# Altium schematic sheet PICO,LCD.SchDoc
size A3; SheetNumber: 1; SheetTotal: 2
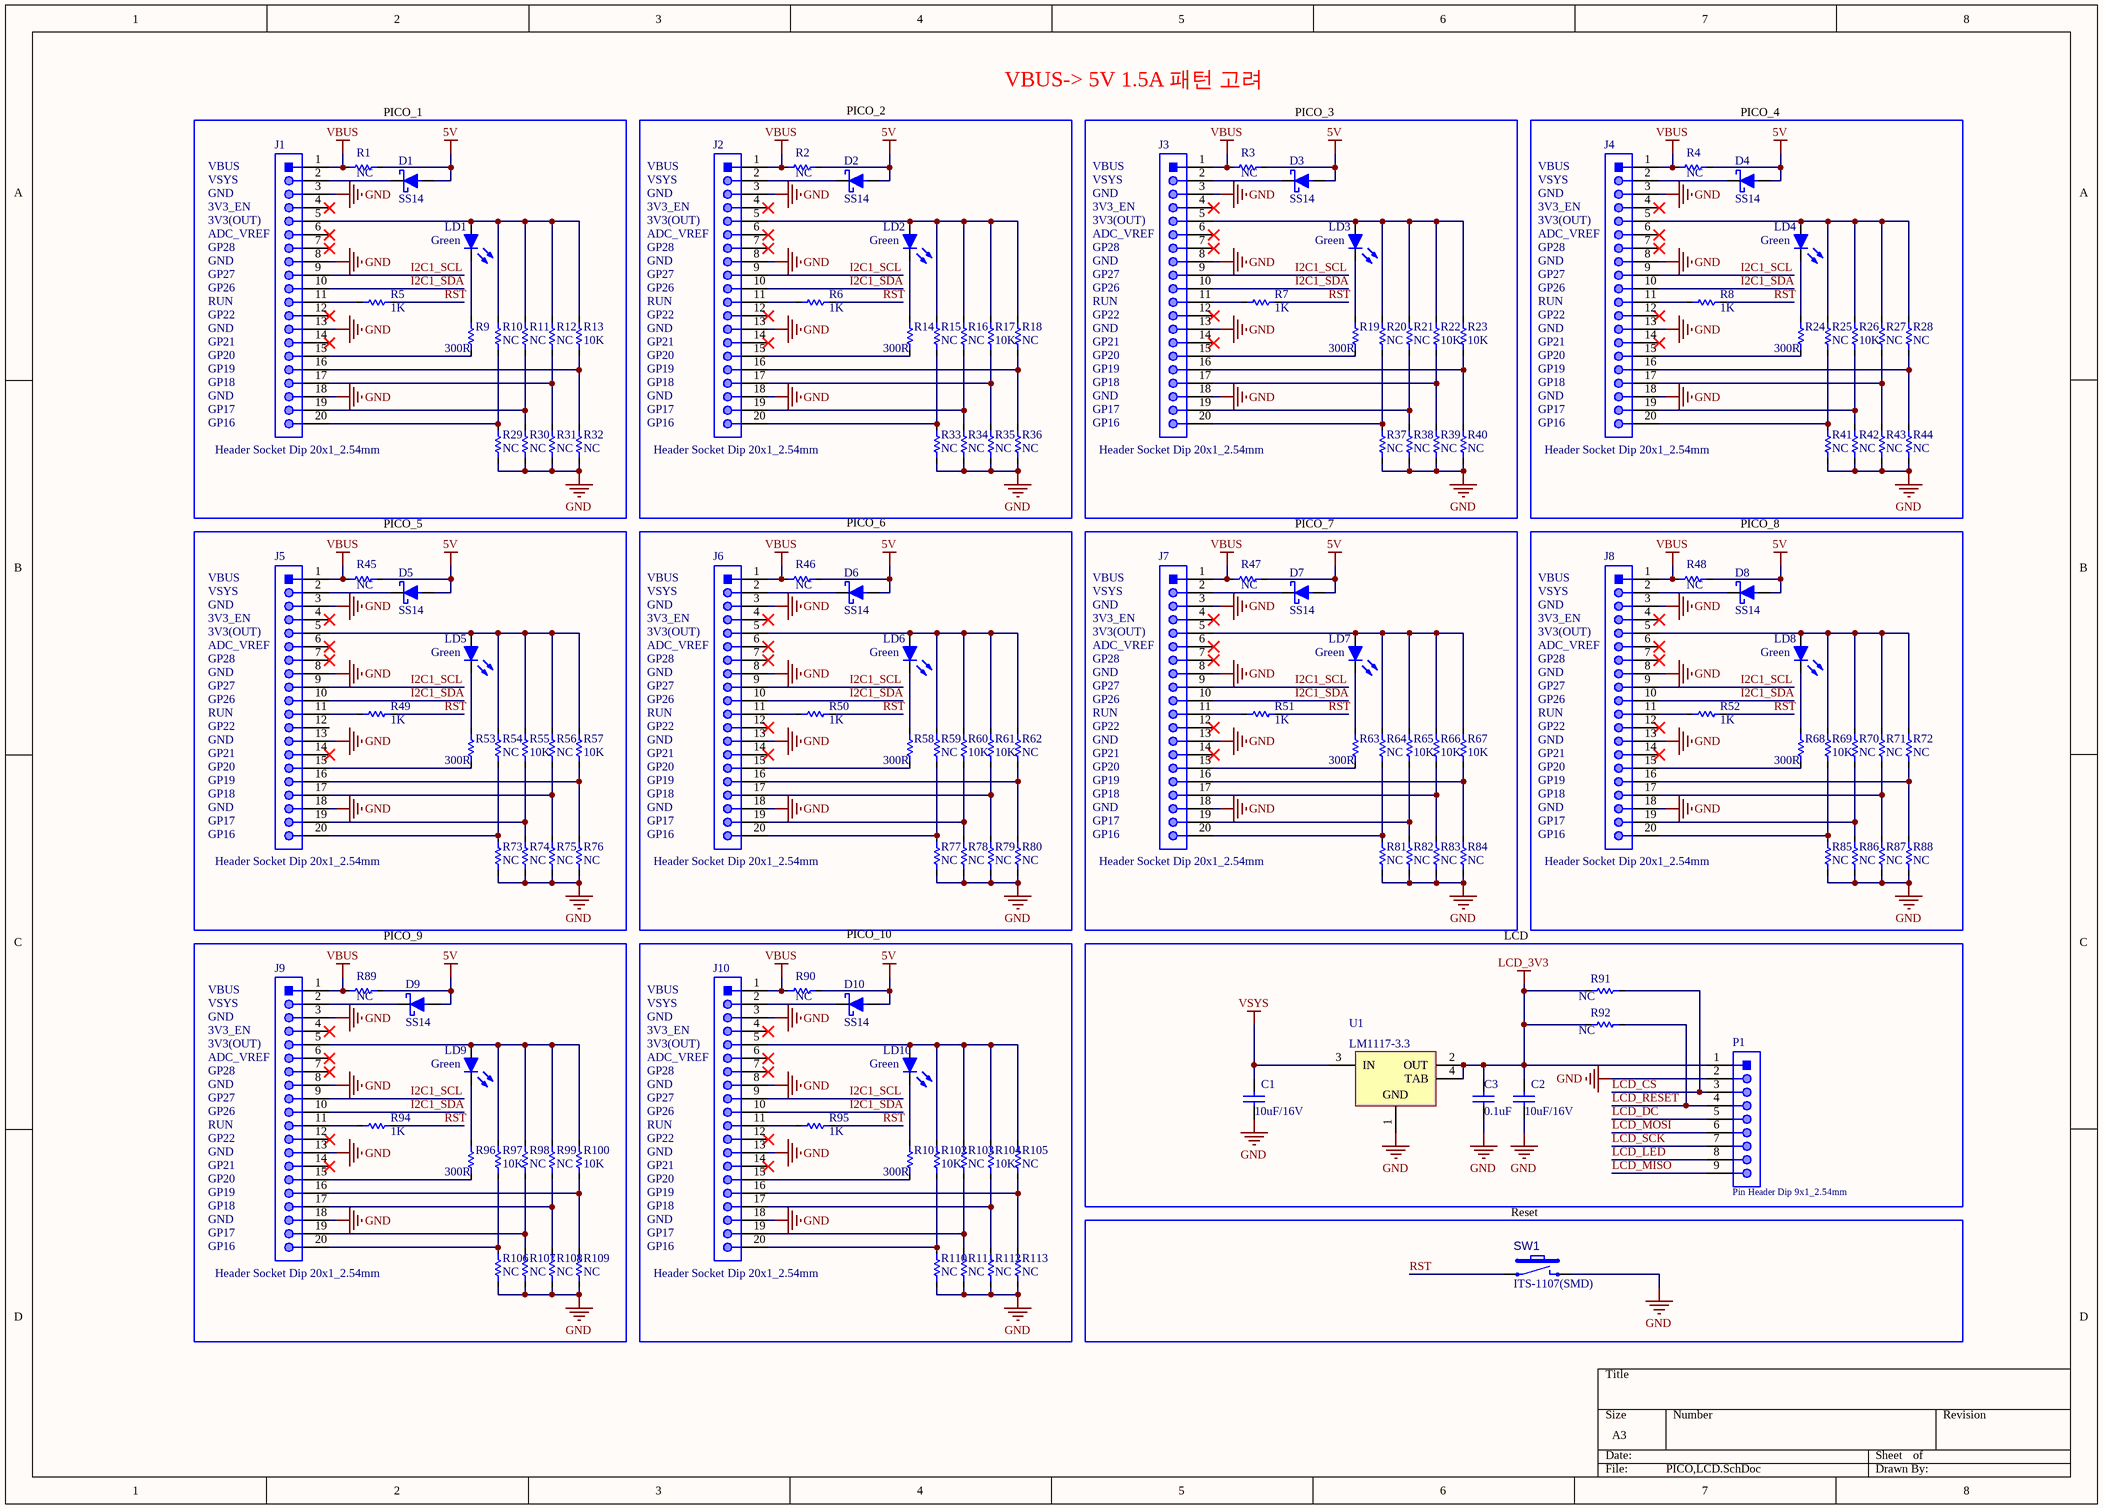
[diagram p0: PICO,LCD.SchDoc]

## Parts
C1  10uF/16V  [CAP-0805]
C2  10uF/16V  [CAP-0805]
C3  0.1uF  [CAP-0603]
D1  SS14  [DO-214AC/SMA]
D2  SS14  [DO-214AC/SMA]
D3  SS14  [DO-214AC/SMA]
D4  SS14  [DO-214AC/SMA]
D5  SS14  [DO-214AC/SMA]
D6  SS14  [DO-214AC/SMA]
D7  SS14  [DO-214AC/SMA]
D8  SS14  [DO-214AC/SMA]
D9  SS14  [DO-214AC/SMA]
D10  SS14  [DO-214AC/SMA]
J1  Header Socket Dip 20x1_2.54mm  [IDC-1X20(SOCKET)]
J2  Header Socket Dip 20x1_2.54mm  [IDC-1X20(SOCKET)]
J3  Header Socket Dip 20x1_2.54mm  [IDC-1X20(SOCKET)]
J4  Header Socket Dip 20x1_2.54mm  [IDC-1X20(SOCKET)]
J5  Header Socket Dip 20x1_2.54mm  [IDC-1X20(SOCKET)]
J6  Header Socket Dip 20x1_2.54mm  [IDC-1X20(SOCKET)]
J7  Header Socket Dip 20x1_2.54mm  [IDC-1X20(SOCKET)]
J8  Header Socket Dip 20x1_2.54mm  [IDC-1X20(SOCKET)]
J9  Header Socket Dip 20x1_2.54mm  [IDC-1X20(SOCKET)]
J10  Header Socket Dip 20x1_2.54mm  [IDC-1X20(SOCKET)]
LD1  Green  [LED-0603-GREEN]
LD2  Green  [LED-0603-GREEN]
LD3  Green  [LED-0603-GREEN]
LD4  Green  [LED-0603-GREEN]
LD5  Green  [LED-0603-GREEN]
LD6  Green  [LED-0603-GREEN]
LD7  Green  [LED-0603-GREEN]
LD8  Green  [LED-0603-GREEN]
LD9  Green  [LED-0603-GREEN]
LD10  Green  [LED-0603-GREEN]
P1  Pin Header Dip 9x1_2.54mm  [LCD(PIN HEADER9X1_2.54)]
R1  NC  [RES-0603]
R2  NC  [RES-0603]
R3  NC  [RES-0603]
R4  NC  [RES-0603]
R5  1K  [RES-0603]
R6  1K  [RES-0603]
R7  1K  [RES-0603]
R8  1K  [RES-0603]
R9  300R  [RES-0603]
R10  NC  [RES-0603]
R11  NC  [RES-0603]
R12  NC  [RES-0603]
R13  10K  [RES-0603]
R14  300R  [RES-0603]
R15  NC  [RES-0603]
R16  NC  [RES-0603]
R17  10K  [RES-0603]
R18  NC  [RES-0603]
R19  300R  [RES-0603]
R20  NC  [RES-0603]
R21  NC  [RES-0603]
R22  10K  [RES-0603]
R23  10K  [RES-0603]
R24  300R  [RES-0603]
R25  NC  [RES-0603]
R26  10K  [RES-0603]
R27  NC  [RES-0603]
R28  NC  [RES-0603]
R29  NC  [RES-0603]
R30  NC  [RES-0603]
R31  NC  [RES-0603]
R32  NC  [RES-0603]
R33  NC  [RES-0603]
R34  NC  [RES-0603]
R35  NC  [RES-0603]
R36  NC  [RES-0603]
R37  NC  [RES-0603]
R38  NC  [RES-0603]
R39  NC  [RES-0603]
R40  NC  [RES-0603]
R41  NC  [RES-0603]
R42  NC  [RES-0603]
R43  NC  [RES-0603]
R44  NC  [RES-0603]
R45  NC  [RES-0603]
R46  NC  [RES-0603]
R47  NC  [RES-0603]
R48  NC  [RES-0603]
R49  1K  [RES-0603]
R50  1K  [RES-0603]
R51  1K  [RES-0603]
R52  1K  [RES-0603]
R53  300R  [RES-0603]
R54  NC  [RES-0603]
R55  10K  [RES-0603]
R56  NC  [RES-0603]
R57  10K  [RES-0603]
R58  300R  [RES-0603]
R59  NC  [RES-0603]
R60  10K  [RES-0603]
R61  10K  [RES-0603]
R62  NC  [RES-0603]
R63  300R  [RES-0603]
R64  NC  [RES-0603]
R65  10K  [RES-0603]
R66  10K  [RES-0603]
R67  10K  [RES-0603]
R68  300R  [RES-0603]
R69  10K  [RES-0603]
R70  NC  [RES-0603]
R71  NC  [RES-0603]
R72  NC  [RES-0603]
R73  NC  [RES-0603]
R74  NC  [RES-0603]
R75  NC  [RES-0603]
R76  NC  [RES-0603]
R77  NC  [RES-0603]
R78  NC  [RES-0603]
R79  NC  [RES-0603]
R80  NC  [RES-0603]
R81  NC  [RES-0603]
R82  NC  [RES-0603]
R83  NC  [RES-0603]
R84  NC  [RES-0603]
R85  NC  [RES-0603]
R86  NC  [RES-0603]
R87  NC  [RES-0603]
R88  NC  [RES-0603]
R89  NC  [RES-0603]
R90  NC  [RES-0603]
R91  NC  [RES-0603]
R92  NC  [RES-0603]
R94  1K  [RES-0603]
R95  1K  [RES-0603]
R96  300R  [RES-0603]
R97  10K  [RES-0603]
R98  NC  [RES-0603]
R99  NC  [RES-0603]
R100  10K  [RES-0603]
R101  300R  [RES-0603]
R102  10K  [RES-0603]
R103  NC  [RES-0603]
R104  10K  [RES-0603]
R105  NC  [RES-0603]
R106  NC  [RES-0603]
R107  NC  [RES-0603]
R108  NC  [RES-0603]
R109  NC  [RES-0603]
R110  NC  [RES-0603]
R111  NC  [RES-0603]
R112  NC  [RES-0603]
R113  NC  [RES-0603]
SW1  ITS-1107(SMD)  [IT-1107(SMD)]
U1  LM1117-3.3  [SOT-223]

## Blocks framed on the sheet
LCD: C1-C3 P1 R91 R92 U1
Reset: SW1

## Nets
5V: D1.1(A) D2.1(A) D3.1(A) D4.1(A) D5.1(A) D6.1(A) D7.1(A) D8.1(A) D9.1(A) D10.1(A) R1.1 R2.1 R3.1 R4.1 R45.1 R46.1 R47.1 R48.1 R89.1 R90.1
GND: C1.1 C2.1 C3.1 J1.3 J1.8 J1.13 J1.18 J2.3 J2.8 J2.13 J2.18 J3.3 J3.8 J3.13 J3.18 J4.3 J4.8 J4.13 J4.18 J5.3 J5.8 J5.13 J5.18 J6.3 J6.8 J6.13 J6.18 J7.3 J7.8 J7.13 J7.18 J8.3 J8.8 J8.13 J8.18 J9.3 J9.8 J9.13 J9.18 J10.3 J10.8 J10.13 J10.18 P1.2 R29.1 R30.1 R31.1 R32.1 R33.1 R34.1 R35.1 R36.1 R37.1 R38.1 R39.1 R40.1 R41.1 R42.1 R43.1 R44.1 R73.1 R74.1 R75.1 R76.1 R77.1 R78.1 R79.1 R80.1 R81.1 R82.1 R83.1 R84.1 R85.1 R86.1 R87.1 R88.1 R106.1 R107.1 R108.1 R109.1 R110.1 R111.1 R112.1 R113.1 SW1.2 U1.1(GND)
LCD_3V3: C2.2 C3.2 P1.1 R91.2 R92.2 U1.2(OUT) U1.4(TAB)
VBUS: J1.1 J2.1 J3.1 J4.1 J5.1 J6.1 J7.1 J8.1 J9.1 J10.1 R1.2 R2.2 R3.2 R4.2 R45.2 R46.2 R47.2 R48.2 R89.2 R90.2
VSYS: C1.2 U1.3(IN)
I2C1_SCL: J1.9 J2.9 J3.9 J4.9 J5.9 J6.9 J7.9 J8.9 J9.9 J10.9
I2C1_SDA: J1.10 J2.10 J3.10 J4.10 J5.10 J6.10 J7.10 J8.10 J9.10 J10.10
LCD_CS: P1.3 R91.1
LCD_DC: P1.5
LCD_LED: P1.8
LCD_MISO: P1.9
LCD_MOSI: P1.6
LCD_RESET: P1.4 R92.1
LCD_SCK: P1.7
RST: R5.1 R6.1 R7.1 R8.1 R49.1 R50.1 R51.1 R52.1 R94.1 R95.1 SW1.1
NetD1_2: D1.2(C) J1.2
NetD2_2: D2.2(C) J2.2
NetD3_2: D3.2(C) J3.2
NetD4_2: D4.2(C) J4.2
NetD5_2: D5.2(C) J5.2
NetD6_2: D6.2(C) J6.2
NetD7_2: D7.2(C) J7.2
NetD8_2: D8.2(C) J8.2
NetD9_2: D9.2(C) J9.2
NetD10_2: D10.2(C) J10.2
NetJ1_5: J1.5 LD1.1(A) R10.2 R11.2 R12.2 R13.2
NetJ1_11: J1.11 R5.2
NetJ1_15: J1.15 R9.2
NetJ1_16: J1.16 R13.1 R32.2
NetJ1_17: J1.17 R12.1 R31.2
NetJ1_19: J1.19 R11.1 R30.2
NetJ1_20: J1.20 R10.1 R29.2
NetJ2_5: J2.5 LD2.1(A) R15.2 R16.2 R17.2 R18.2
NetJ2_11: J2.11 R6.2
NetJ2_15: J2.15 R14.2
NetJ2_16: J2.16 R18.1 R36.2
NetJ2_17: J2.17 R17.1 R35.2
NetJ2_19: J2.19 R16.1 R34.2
NetJ2_20: J2.20 R15.1 R33.2
NetJ3_5: J3.5 LD3.1(A) R20.2 R21.2 R22.2 R23.2
NetJ3_11: J3.11 R7.2
NetJ3_15: J3.15 R19.2
NetJ3_16: J3.16 R23.1 R40.2
NetJ3_17: J3.17 R22.1 R39.2
NetJ3_19: J3.19 R21.1 R38.2
NetJ3_20: J3.20 R20.1 R37.2
NetJ4_5: J4.5 LD4.1(A) R25.2 R26.2 R27.2 R28.2
NetJ4_11: J4.11 R8.2
NetJ4_15: J4.15 R24.2
NetJ4_16: J4.16 R28.1 R44.2
NetJ4_17: J4.17 R27.1 R43.2
NetJ4_19: J4.19 R26.1 R42.2
NetJ4_20: J4.20 R25.1 R41.2
NetJ5_5: J5.5 LD5.1(A) R54.2 R55.2 R56.2 R57.2
NetJ5_11: J5.11 R49.2
NetJ5_15: J5.15 R53.2
NetJ5_16: J5.16 R57.1 R76.2
NetJ5_17: J5.17 R56.1 R75.2
NetJ5_19: J5.19 R55.1 R74.2
NetJ5_20: J5.20 R54.1 R73.2
NetJ6_5: J6.5 LD6.1(A) R59.2 R60.2 R61.2 R62.2
NetJ6_11: J6.11 R50.2
NetJ6_15: J6.15 R58.2
NetJ6_16: J6.16 R62.1 R80.2
NetJ6_17: J6.17 R61.1 R79.2
NetJ6_19: J6.19 R60.1 R78.2
NetJ6_20: J6.20 R59.1 R77.2
NetJ7_5: J7.5 LD7.1(A) R64.2 R65.2 R66.2 R67.2
NetJ7_11: J7.11 R51.2
NetJ7_15: J7.15 R63.2
NetJ7_16: J7.16 R67.1 R84.2
NetJ7_17: J7.17 R66.1 R83.2
NetJ7_19: J7.19 R65.1 R82.2
NetJ7_20: J7.20 R64.1 R81.2
NetJ8_5: J8.5 LD8.1(A) R69.2 R70.2 R71.2 R72.2
NetJ8_11: J8.11 R52.2
NetJ8_15: J8.15 R68.2
NetJ8_16: J8.16 R72.1 R88.2
NetJ8_17: J8.17 R71.1 R87.2
NetJ8_19: J8.19 R70.1 R86.2
NetJ8_20: J8.20 R69.1 R85.2
NetJ9_5: J9.5 LD9.1(A) R97.2 R98.2 R99.2 R100.2
NetJ9_11: J9.11 R94.2
NetJ9_15: J9.15 R96.2
NetJ9_16: J9.16 R100.1 R109.2
NetJ9_17: J9.17 R99.1 R108.2
NetJ9_19: J9.19 R98.1 R107.2
NetJ9_20: J9.20 R97.1 R106.2
NetJ10_5: J10.5 LD10.1(A) R102.2 R103.2 R104.2 R105.2
NetJ10_11: J10.11 R95.2
NetJ10_15: J10.15 R101.2
NetJ10_16: J10.16 R105.1 R113.2
NetJ10_17: J10.17 R104.1 R112.2
NetJ10_19: J10.19 R103.1 R111.2
NetJ10_20: J10.20 R102.1 R110.2
NetLD1_2: LD1.2(K) R9.1
NetLD2_2: LD2.2(K) R14.1
NetLD3_2: LD3.2(K) R19.1
NetLD4_2: LD4.2(K) R24.1
NetLD5_2: LD5.2(K) R53.1
NetLD6_2: LD6.2(K) R58.1
NetLD7_2: LD7.2(K) R63.1
NetLD8_2: LD8.2(K) R68.1
NetLD9_2: LD9.2(K) R96.1
NetLD10_2: LD10.2(K) R101.1

Not connected (* = marked no-connect by the designer): J1 4* 6* 7* 12* 14*; J2 4* 6* 7* 12* 14*; J3 4* 6* 7* 12* 14*; J4 4* 6* 7* 12* 14*; J5 4* 6* 7* 12 14*; J6 4* 6* 7* 12* 14*; J7 4* 6* 7* 12* 14*; J8 4* 6* 7* 12* 14*; J9 4* 6* 7* 12* 14*; J10 4* 6* 7* 12* 14*

## Notes on the sheet
- PICO_2
- VBUS-> 5V 1.5A 패턴 고려
- VBUS
- VSYS
- PICO_1
- PICO_3
- PICO_4
- GND
- 3V3_EN
- (near J1) 3V3(OUT)
- (near J1) ADC_VREF
- (near J2) 3V3(OUT)
- (near J2) ADC_VREF
- (near J3) 3V3(OUT)
- (near J3) ADC_VREF
- (near J4) 3V3(OUT)
- (near J4) ADC_VREF
- GP28
- GP27
- GP26
- RUN
- GP22
- GP21
- GP20
- GP19
- GP18
- GP17
- GP16
- PICO_5
- PICO_6
- PICO_7
- PICO_8
- (near J5) 3V3(OUT)
- (near J5) ADC_VREF
- (near J6) 3V3(OUT)
- (near J6) ADC_VREF
- (near J7) 3V3(OUT)
- (near J7) ADC_VREF
- (near J8) 3V3(OUT)
- (near J8) ADC_VREF
- PICO_9
- PICO_10
- (near J9) 3V3(OUT)
- (near J10) 3V3(OUT)
- (near J9) ADC_VREF
- (near J10) ADC_VREF

## Library data of the parts
C1 C2 = CAP-0805: MLCC-0805(2012)
C3 = CAP-0603: MLCC-0603(1608)
D1-D10 = DIODE-Shottky SMA(DO-214AC): DIODE SCHOTTKY 40V 1A SMA; Manufacturer: ON Semiconductor; Peak Reverse Current: 0.2mA; Max Junction Temp: +125°C; Standoff Height: 0.05mm; Max Surge Forward Current: 40A; Mouser Description: Schottky Diodes & Rectifiers SMA 40V 1.0A; RoHS: TRUE; Lead Free: Yes; Manufacturer Part Number: SS14; Device Class L3: Schottky Diodes; Category: Diode; Automotive: No; Digikey Description: DIODE SCHOTTKY 40V 1A SMA; ComponentLink2Description: Datasheet; Device Class L2: Diodes; Height: 2.5mm; Temperature Range High: +125°C; ComponentLink2URL: https://www.onsemi.com/pub/Collateral/SS19-D.PDF; Device Class L1: Discrete Semiconductors; Package: 403AE; Octopart: https://octopart.com/ss14-on+semiconductor-29205033; Max Repetitive Reverse Voltage: 40V; Temperature Range Low: -65°C; Forward Current: 1A; Temperature: -65°C to +125°C
J1-J10 = Header Socket 20x1_2.54mm: THT Vertical Header Socket WR-PHD, Pitch 2.54 mm, Single Row, 20 pins; Manufacturer_Name: Harwin; Manufacturer_Part_Number: M20-7822046; Datasheet Link: https://www.harwin.com/products/M20-7822046/; Height: 8.65mm; Mouser Part Number: 855-M20-7822046; Mouser Price/Stock: https://www.mouser.co.uk/ProductDetail/Harwin/M20-7822046?qs=ulE8k0yEMYayyds2fKN7wQ%3D%3D
LD1-LD10 = GREEN LED-0603: LED-0603
P1 = Pin Header 9x1_2.54mm: THT Vertical Pin Header WR-PHD, Pitch 2.54 mm, Single Row, 9 pins; Part Number: 61300911121; Manufacturer: Wurth Elektronik; Pitch: 2.54mm; Gender: Male; Working Voltage: 250VAC; Contact Resistance: 20mOhm; Withstanding Voltage: 500VAC; Pin Number: 9; Rated Current: 3A; Package Reference: 61300911121; Mounting Technology: THT; Publisher: WurthElektronik; Manufacturer URL: http://www.we-online.de; Orientation: Vertical; Datasheet URL: https://katalog.we-online.de/em/datasheet/6130xx11121.pdf; Operating Temperature: -40to105degC; Row Number: Single; Packaging: Bag
R1-R92 R94-R113 = RES-0603: Chip Resistor 0603(1608); Manufacturer: Yageo; Power Rating: 100mW; Voltage Rating: 50V; Tolerance: 1%; Temperature Coefficient: 100ppm/degreesC; Resistance: 1.5KOhm; Military Standard: Not; Datasheet URL: http://www.yageo.com/NewPortal/yageodocoutput?fileName=/pdf/R-Chip/PYu-RC_Group_51_RoHS_L_5.pdf; Package Description: 2-Pin Surface Mount Device, Body 1.6 x 0.8 mm; Composition: ThickFilm; Case Code (Metric): 1608; Case/Package: 0603; Number of Terminations: 2; Depth: 0.8mm; Height: 0.022inch; Manufacturer URL: http://www.yageo.com/; Lead Free: LeadFree; Min Operating Temperature: -55degC; Max Operating Temperature: 155degC; Datasheet Version: Rev. 5, 10/2016; RoHSCompliant: true; Max Power Dissipation: 100mW; Packaging: TapeandReel; Voltage Rating (DC): 50V; Length: 0.063inch; Width: 0.031inch; Number of Pins: 2; Termination: SMD/SMT; Package Reference: 0603; Package Quantity: 1; Case Code (Imperial): 0603; REACH SVHC: NoSVHC
SW1 = ITS-1107(SMD): TACT Switch (SMD)
U1 = LM1117: 800mA Low-Dropout Linear Regulator, 4-pin SOT-223, Pb-Free; PartNumber: LM1117IMP-3.3/NOPB; Manufacturer: Texas Instruments; PackageTopMarking: XYTT*N05B; PowerWise: N; High-Reliability: Y; CompType: LDO IC; Code_IPC: SOT223-4; PackageReference: DCY0004A; PinCount: 4; PackageDescription: Molded SOT-223, 6.50 x 3.56 x 1.6mm Body, 4 Lead, 2.3mm Pitch; RoHS: Y; ComponentLink1Description: Datasheet URL; Code_JEDEC: TO-261-AA; ComponentLink1URL: http://www.ti.com/general/docs/lit/getliterature.tsp?genericPartNumber=LM1117-N&fileType=pdf